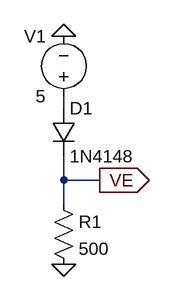
[diagram p0: schematic lab4_task1_part1_500.asc]
lab4_task1_part1_500.asc, the LTspice schematic file:
Version 4.1
SHEET 1 880 680
WIRE 80 144 80 128
WIRE 80 240 80 208
WIRE 128 240 80 240
WIRE 80 272 80 240
FLAG 80 352 0
FLAG 128 240 VE
IOPIN 128 240 Out
FLAG 80 48 0
SYMBOL voltage 80 144 R180
WINDOW 0 24 96 Left 2
WINDOW 3 24 16 Left 2
WINDOW 123 0 0 Left 0
WINDOW 39 0 0 Left 0
SYMATTR InstName V1
SYMATTR Value 5
SYMBOL diode 64 144 R0
SYMATTR InstName D1
SYMATTR Value 1N4148
SYMBOL res 64 256 R0
SYMATTR InstName R1
SYMATTR Value 500

The netlist it stands for:
* lab4_task1_part1_500.asc
V1 N001 0 5
D1 N001 VE 1N4148
R1 VE 0 500
.model D D
.lib standard.dio
.backanno
.end